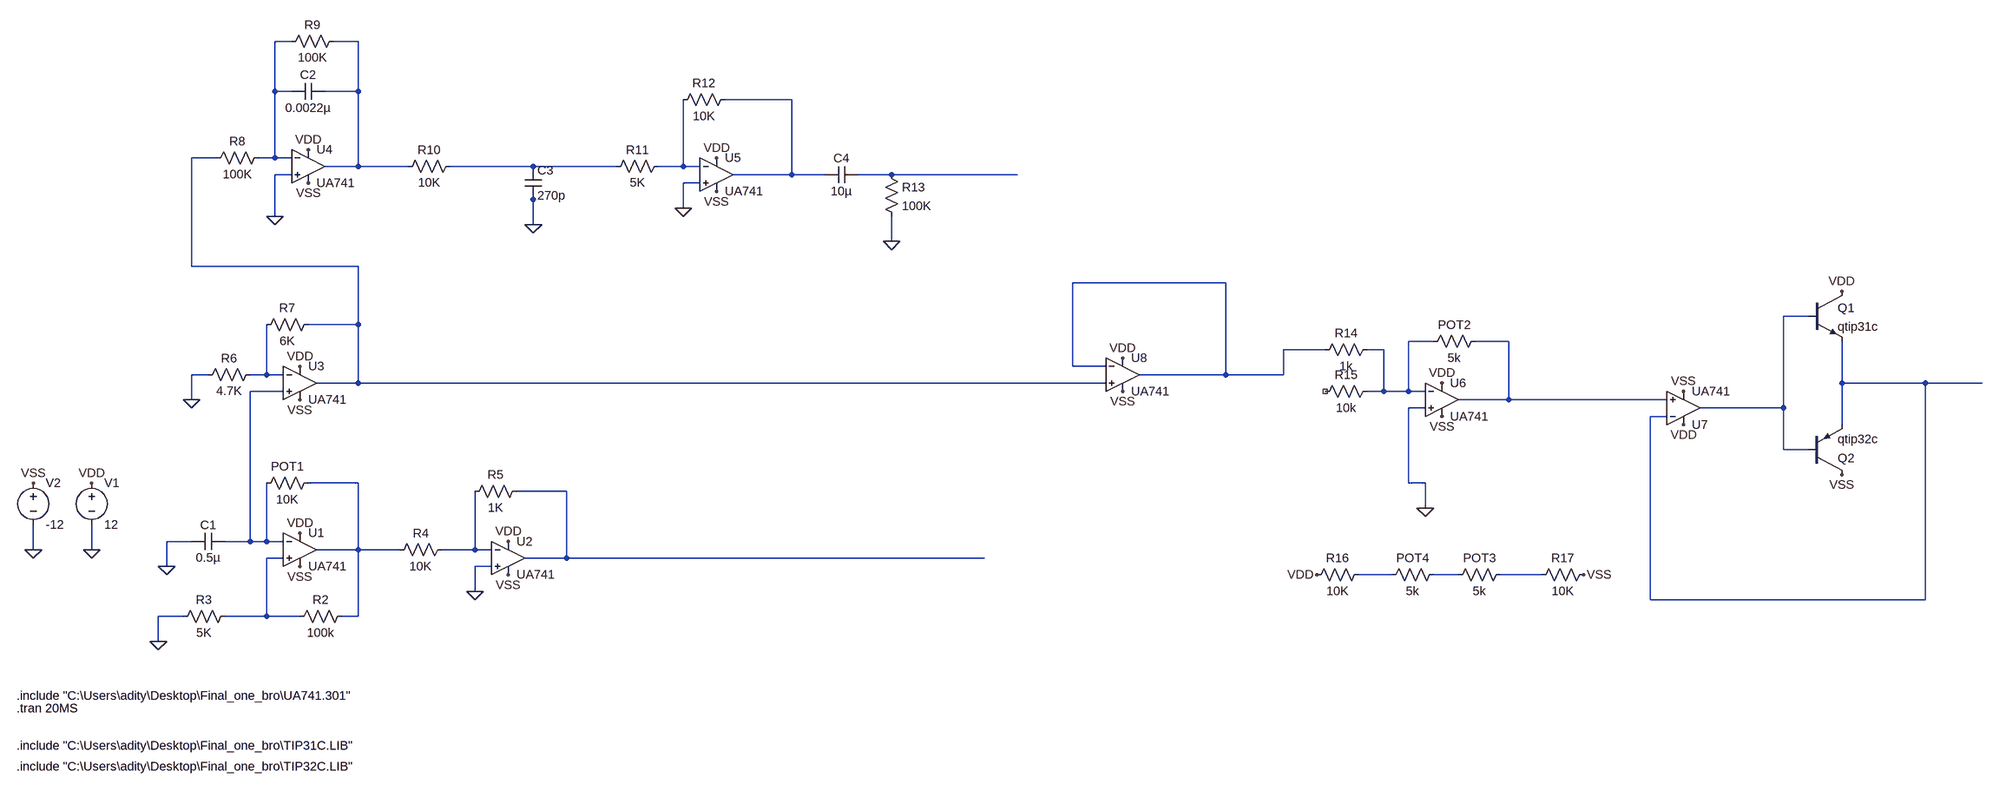
[diagram p0: schematic FInal_Final_Final ckt.asc]
FInal_Final_Final ckt.asc, the LTspice schematic file:
Version 4
SHEET 1 4292 680
WIRE 208 -800 176 -800
WIRE 336 -800 288 -800
WIRE 176 -704 176 -800
WIRE 208 -704 176 -704
WIRE 336 -704 336 -800
WIRE 336 -704 272 -704
WIRE 1168 -688 1040 -688
WIRE 64 -576 16 -576
WIRE 176 -576 176 -704
WIRE 176 -576 144 -576
WIRE 208 -576 176 -576
WIRE 336 -560 336 -704
WIRE 336 -560 272 -560
WIRE 432 -560 336 -560
WIRE 672 -560 512 -560
WIRE 832 -560 672 -560
WIRE 960 -560 960 -688
WIRE 960 -560 912 -560
WIRE 992 -560 960 -560
WIRE 208 -544 176 -544
WIRE 1168 -544 1168 -688
WIRE 1168 -544 1056 -544
WIRE 1232 -544 1168 -544
WIRE 1360 -544 1296 -544
WIRE 1632 -544 1360 -544
WIRE 992 -528 960 -528
WIRE 672 -496 672 -512
WIRE 960 -480 960 -528
WIRE 176 -464 176 -544
WIRE 672 -448 672 -496
WIRE 1360 -416 1360 -464
WIRE 16 -368 16 -576
WIRE 336 -368 16 -368
WIRE 2112 -336 1776 -336
WIRE 3264 -272 3216 -272
WIRE 336 -256 336 -368
WIRE 336 -256 240 -256
WIRE 2544 -224 2496 -224
WIRE 2688 -224 2624 -224
WIRE 2336 -208 2256 -208
WIRE 2448 -208 2416 -208
WIRE 1776 -176 1776 -336
WIRE 1840 -176 1776 -176
WIRE 48 -160 16 -160
WIRE 160 -160 160 -256
WIRE 160 -160 128 -160
WIRE 192 -160 160 -160
WIRE 2112 -160 2112 -336
WIRE 2112 -160 1904 -160
WIRE 2256 -160 2256 -208
WIRE 2256 -160 2112 -160
WIRE 336 -144 336 -256
WIRE 336 -144 256 -144
WIRE 1840 -144 336 -144
WIRE 3328 -144 3328 -224
WIRE 3488 -144 3328 -144
WIRE 3616 -144 3488 -144
WIRE 192 -128 128 -128
WIRE 2448 -128 2448 -208
WIRE 2448 -128 2416 -128
WIRE 2496 -128 2496 -224
WIRE 2496 -128 2448 -128
WIRE 2528 -128 2496 -128
WIRE 16 -112 16 -160
WIRE 2688 -112 2688 -224
WIRE 2688 -112 2592 -112
WIRE 2992 -112 2688 -112
WIRE 2528 -96 2496 -96
WIRE 3216 -96 3216 -272
WIRE 3216 -96 3056 -96
WIRE 2992 -80 2960 -80
WIRE 3328 -64 3328 -144
WIRE 3216 -16 3216 -96
WIRE 3264 -16 3216 -16
WIRE 336 48 240 48
WIRE 2496 48 2496 -96
WIRE 2528 48 2496 48
WIRE 736 64 640 64
WIRE 2528 96 2528 48
WIRE 16 160 -32 160
WIRE 128 160 128 -128
WIRE 128 160 80 160
WIRE 160 160 160 48
WIRE 160 160 128 160
WIRE 192 160 160 160
WIRE -288 176 -288 128
WIRE -176 176 -176 128
WIRE 336 176 336 48
WIRE 336 176 256 176
WIRE 416 176 336 176
WIRE 560 176 560 64
WIRE 560 176 496 176
WIRE 592 176 560 176
WIRE 192 192 160 192
WIRE 736 192 736 64
WIRE 736 192 656 192
WIRE 1568 192 736 192
WIRE -32 208 -32 160
WIRE 592 208 560 208
WIRE 2464 224 2400 224
WIRE 2592 224 2544 224
WIRE 2752 224 2672 224
WIRE 560 256 560 208
WIRE 2960 272 2960 -80
WIRE 3488 272 3488 -144
WIRE 3488 272 2960 272
WIRE 0 304 -48 304
WIRE 160 304 160 192
WIRE 160 304 80 304
WIRE 224 304 160 304
WIRE 336 304 336 176
WIRE 336 304 304 304
WIRE -48 352 -48 304
FLAG -32 208 0
FLAG -48 352 0
FLAG -176 48 VDD
FLAG 224 144 VDD
FLAG -288 48 VSS
FLAG 224 208 VSS
FLAG -288 176 0
FLAG -176 176 0
FLAG 560 256 0
FLAG 624 160 VDD
FLAG 624 224 VSS
FLAG 16 -112 0
FLAG 224 -176 VDD
FLAG 224 -112 VSS
FLAG 240 -592 VDD
FLAG 240 -528 VSS
FLAG 176 -464 0
FLAG 960 -480 0
FLAG 672 -448 0
FLAG 1024 -576 VDD
FLAG 1024 -512 VSS
FLAG 1360 -416 0
FLAG 3328 -320 VDD
FLAG 3328 32 VSS
FLAG 2560 -144 VDD
FLAG 3024 -64 VDD
FLAG 2560 -80 VSS
FLAG 3024 -128 VSS
FLAG 2320 224 VDD
FLAG 2832 224 VSS
FLAG 2528 96 0
FLAG 1872 -192 VDD
FLAG 1872 -128 VSS
SYMBOL OpAmps\\opamp2 224 112 R0
SYMATTR InstName U1
SYMATTR Value UA741
SYMBOL cap 80 144 R90
WINDOW 0 0 32 VBottom 2
WINDOW 3 32 32 VTop 2
SYMATTR InstName C1
SYMATTR Value 0.5µ
SYMBOL res 256 32 R90
WINDOW 0 0 56 VBottom 2
WINDOW 3 32 56 VTop 2
SYMATTR InstName POT1
SYMATTR Value 10K
SYMBOL res 320 288 R90
WINDOW 0 0 56 VBottom 2
WINDOW 3 32 56 VTop 2
SYMATTR InstName R2
SYMATTR Value 100k
SYMBOL res 96 288 R90
WINDOW 0 0 56 VBottom 2
WINDOW 3 32 56 VTop 2
SYMATTR InstName R3
SYMATTR Value 5K
SYMBOL voltage -176 32 R0
WINDOW 123 0 0 Left 0
WINDOW 39 0 0 Left 0
SYMATTR InstName V1
SYMATTR Value 12
SYMBOL voltage -288 32 R0
WINDOW 123 0 0 Left 0
WINDOW 39 0 0 Left 0
SYMATTR InstName V2
SYMATTR Value -12
SYMBOL OpAmps\\opamp2 624 128 R0
SYMATTR InstName U2
SYMATTR Value UA741
SYMBOL res 512 160 R90
WINDOW 0 0 56 VBottom 2
WINDOW 3 32 56 VTop 2
SYMATTR InstName R4
SYMATTR Value 10K
SYMBOL res 656 48 R90
WINDOW 0 0 56 VBottom 2
WINDOW 3 32 56 VTop 2
SYMATTR InstName R5
SYMATTR Value 1K
SYMBOL OpAmps\\opamp2 224 -208 R0
SYMATTR InstName U3
SYMATTR Value UA741
SYMBOL res 144 -176 R90
WINDOW 0 0 56 VBottom 2
WINDOW 3 32 56 VTop 2
SYMATTR InstName R6
SYMATTR Value 4.7K
SYMBOL res 256 -272 R90
WINDOW 0 0 56 VBottom 2
WINDOW 3 32 56 VTop 2
SYMATTR InstName R7
SYMATTR Value 6K
SYMBOL OpAmps\\opamp2 240 -624 R0
SYMATTR InstName U4
SYMATTR Value UA741
SYMBOL res 160 -592 R90
WINDOW 0 0 56 VBottom 2
WINDOW 3 32 56 VTop 2
SYMATTR InstName R8
SYMATTR Value 100K
SYMBOL cap 272 -720 R90
WINDOW 0 0 32 VBottom 2
WINDOW 3 32 32 VTop 2
SYMATTR InstName C2
SYMATTR Value 0.0022µ
SYMBOL res 304 -816 R90
WINDOW 0 0 56 VBottom 2
WINDOW 3 32 56 VTop 2
SYMATTR InstName R9
SYMATTR Value 100K
SYMBOL res 528 -576 R90
WINDOW 0 0 56 VBottom 2
WINDOW 3 32 56 VTop 2
SYMATTR InstName R10
SYMATTR Value 10K
SYMBOL cap 656 -560 R0
SYMATTR InstName C3
SYMATTR Value 270p
SYMBOL OpAmps\\opamp2 1024 -608 R0
SYMATTR InstName U5
SYMATTR Value UA741
SYMBOL res 928 -576 R90
WINDOW 0 0 56 VBottom 2
WINDOW 3 32 56 VTop 2
SYMATTR InstName R11
SYMATTR Value 5K
SYMBOL res 1056 -704 R90
WINDOW 0 0 56 VBottom 2
WINDOW 3 32 56 VTop 2
SYMATTR InstName R12
SYMATTR Value 10K
SYMBOL cap 1296 -560 R90
WINDOW 0 0 32 VBottom 2
WINDOW 3 32 32 VTop 2
SYMATTR InstName C4
SYMATTR Value 10µ
SYMBOL res 1344 -560 R0
SYMATTR InstName R13
SYMATTR Value 100K
SYMBOL OpAmps\\opamp2 2560 -176 R0
SYMATTR InstName U6
SYMATTR Value UA741
SYMBOL OpAmps\\opamp2 3024 -32 M180
SYMATTR InstName U7
SYMATTR Value UA741
SYMBOL res 2432 -224 R90
WINDOW 0 0 56 VBottom 2
WINDOW 3 32 56 VTop 2
SYMATTR InstName R14
SYMATTR Value 1k
SYMBOL res 2432 -144 R90
WINDOW 0 0 56 VBottom 2
WINDOW 3 32 56 VTop 2
SYMATTR InstName R15
SYMATTR Value 10k
SYMBOL res 2640 -240 R90
WINDOW 0 0 56 VBottom 2
WINDOW 3 32 56 VTop 2
SYMATTR InstName POT2
SYMATTR Value 5k
SYMBOL npn 3264 -320 R0
SYMATTR InstName Q1
SYMATTR Value qtip31c
SYMBOL pnp 3264 32 M180
SYMATTR InstName Q2
SYMATTR Value qtip32c
SYMBOL res 2416 208 R90
WINDOW 0 0 56 VBottom 2
WINDOW 3 32 56 VTop 2
SYMATTR InstName R16
SYMATTR Value 10K
SYMBOL res 2848 208 R90
WINDOW 0 0 56 VBottom 2
WINDOW 3 32 56 VTop 2
SYMATTR InstName R17
SYMATTR Value 10K
SYMBOL res 2560 208 R90
WINDOW 0 0 56 VBottom 2
WINDOW 3 32 56 VTop 2
SYMATTR InstName POT4
SYMATTR Value 5k
SYMBOL res 2688 208 R90
WINDOW 0 0 56 VBottom 2
WINDOW 3 32 56 VTop 2
SYMATTR InstName POT3
SYMATTR Value 5k
SYMBOL OpAmps\\opamp2 1872 -224 R0
SYMATTR InstName U8
SYMATTR Value UA741
TEXT -320 456 Left 2 !.include "C:\\Users\\adity\\Desktop\\Final_one_bro\\UA741.301"
TEXT -320 480 Left 2 !.tran 20MS
TEXT -320 552 Left 2 !.include "C:\\Users\\adity\\Desktop\\Final_one_bro\\TIP31C.LIB"
TEXT -320 592 Left 2 !.include "C:\\Users\\adity\\Desktop\\Final_one_bro\\TIP32C.LIB"

The netlist it stands for:
* FInal_Final_Final ckt.asc
XU1 N018 N014 VDD VSS N015 UA741  ; pins In+ In- V+ V- OUT
C1 N014 0 0.5µ
R§POT1 N015 N014 10K
R2 N015 N018 100k
R3 N018 0 5K
V1 VDD 0 12
V2 VSS 0 -12
XU2 0 N017 VDD VSS N016 UA741  ; pins In+ In- V+ V- OUT
R4 N017 N015 10K
R5 N016 N017 1K
XU3 N014 N012 VDD VSS N004 UA741  ; pins In+ In- V+ V- OUT
R6 N012 0 4.7K
R7 N004 N012 6K
XU4 0 N001 VDD VSS N002 UA741  ; pins In+ In- V+ V- OUT
R8 N001 N004 100K
C2 N002 N001 0.0022µ
R9 N002 N001 100K
R10 N005 N002 10K
C3 N005 0 270p
XU5 0 N006 VDD VSS N003 UA741  ; pins In+ In- V+ V- OUT
R11 N006 N005 5K
R12 N003 N006 10K
C4 N007 N003 10µ
R13 N007 0 100K
XU6 0 N010 VDD VSS N011 UA741  ; pins In+ In- V+ V- OUT
XU7 N011 N013 VDD VSS N009 UA741  ; pins In+ In- V+ V- OUT
R14 N010 N008 1k
R15 N010 NC_01 10k
R§POT2 N011 N010 5k
Q1 VDD N009 N013 0 qtip31c
Q2 VSS N009 N013 0 qtip32c
R16 N019 VDD 10K
R17 VSS N021 10K
R§POT4 N020 N019 5k
R§POT3 N021 N020 5k
XU8 N004 N008 VDD VSS N008 UA741  ; pins In+ In- V+ V- OUT
.model NPN NPN
.model PNP PNP
.lib standard.bjt
.include "C:\Users\adity\Desktop\Final_one_bro\UA741.301"
.tran 20MS
.include "C:\Users\adity\Desktop\Final_one_bro\TIP31C.LIB"
.include "C:\Users\adity\Desktop\Final_one_bro\TIP32C.LIB"
.backanno
.end